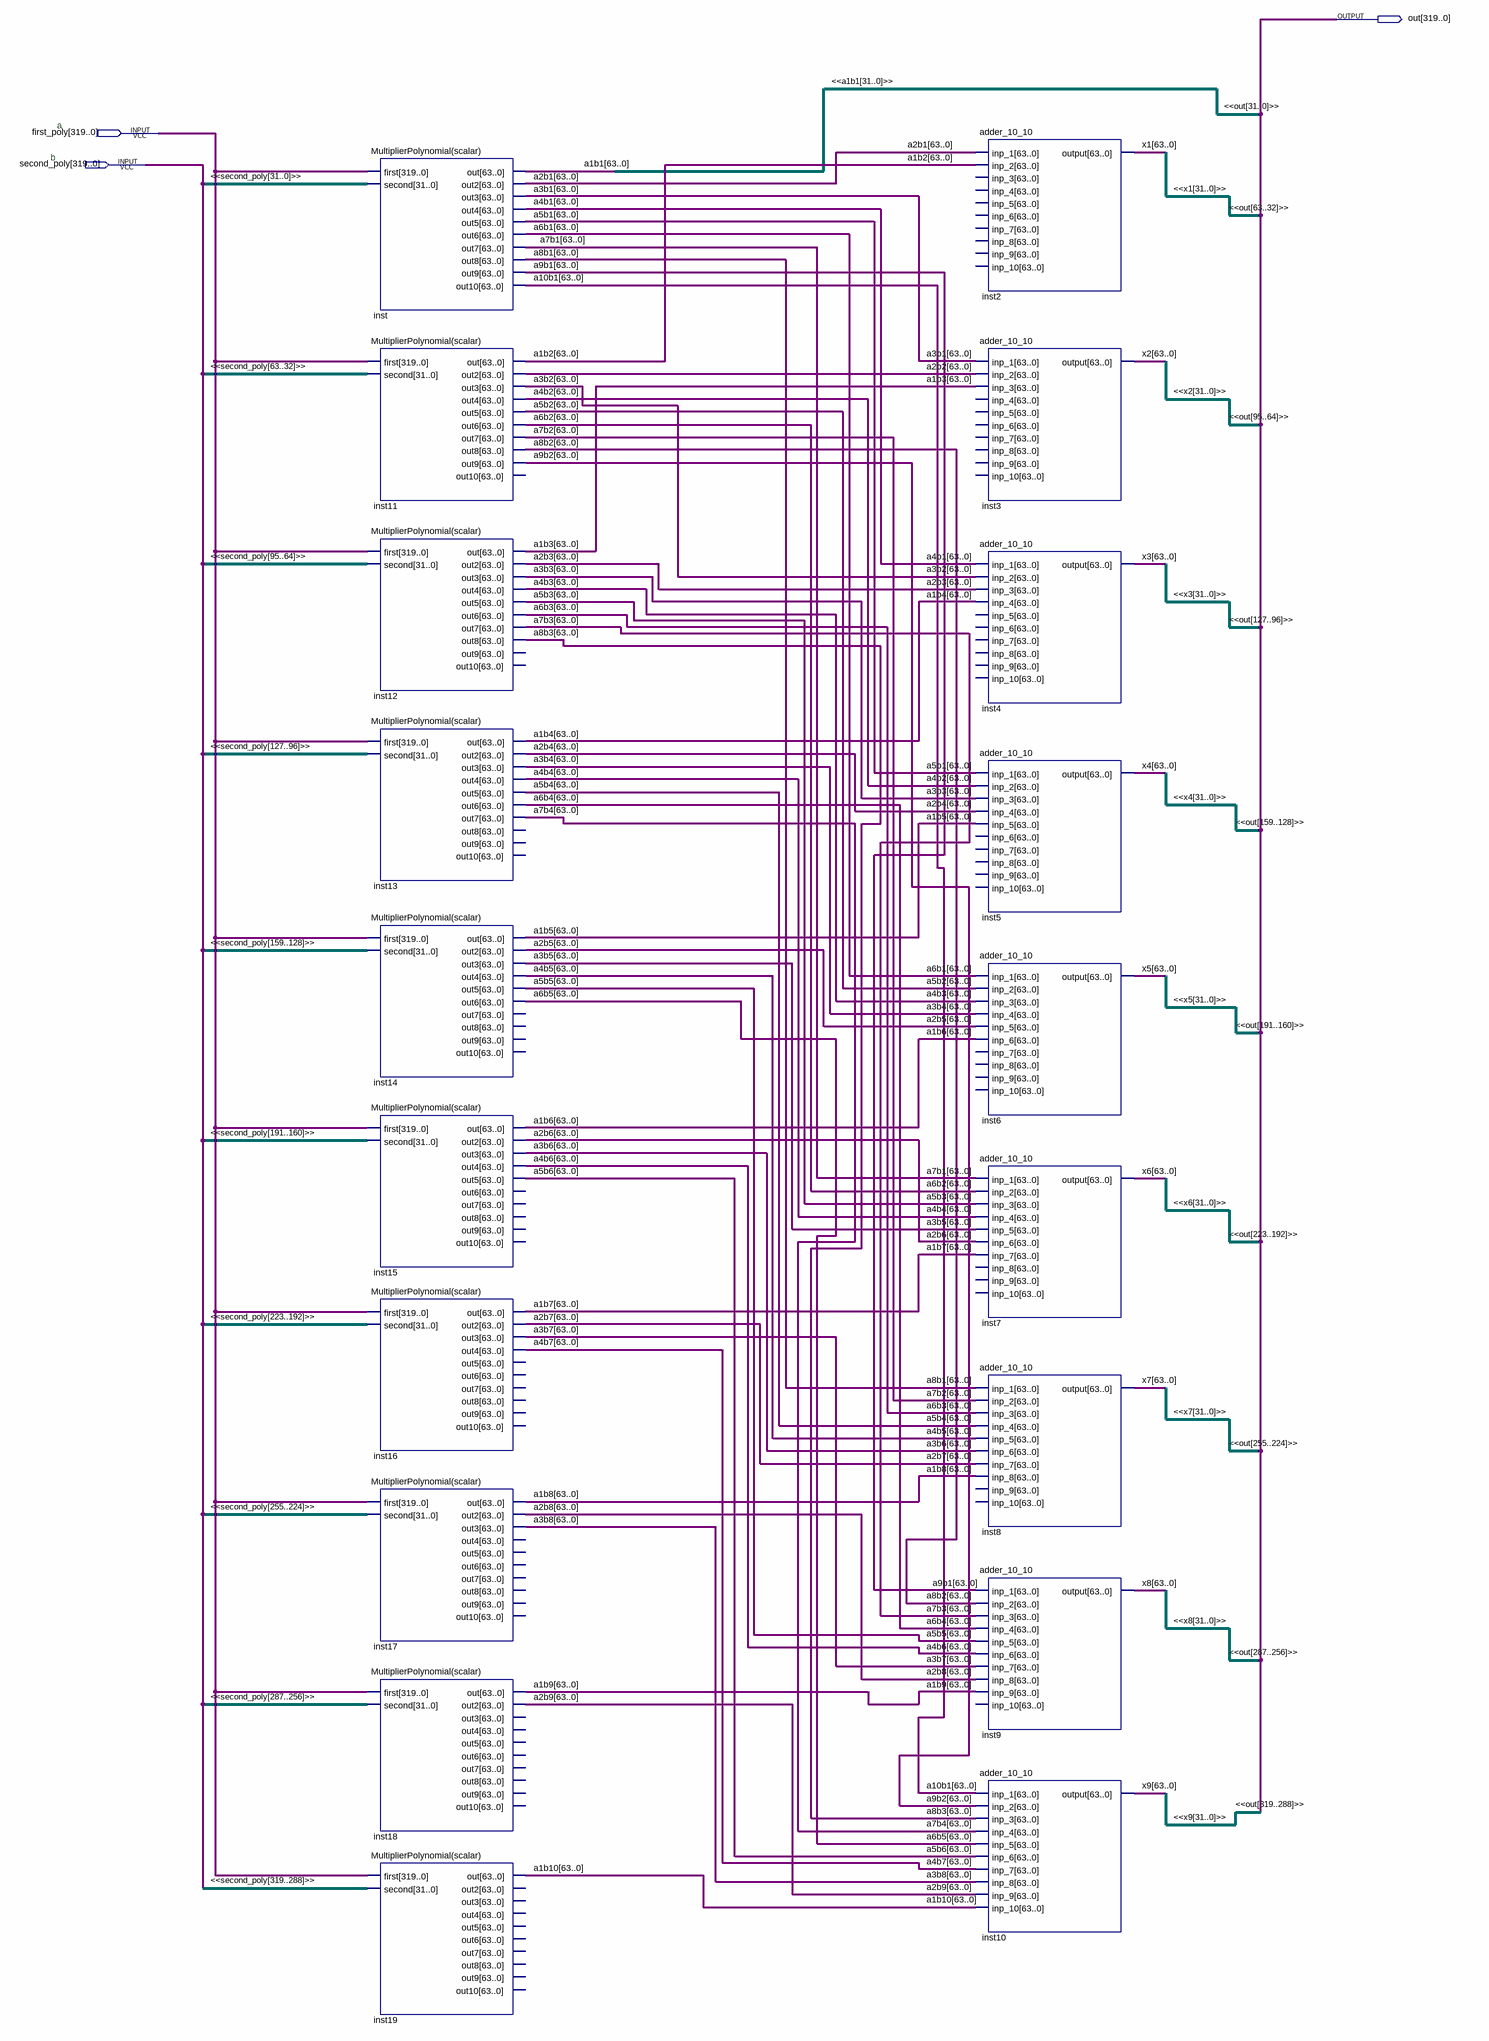
[diagram p0: schematic sheet]
// Quartus schematic MultiplierPolynomial(multi).bdf as structural Verilog: 19 symbols, 3 pins
module \MultiplierPolynomial(multi)  (
  input  [319:0] first_poly,
  input  [319:0] second_poly,
  output [319:0] out
);

  wire [63:0] a1b1, a1b2, a1b3, a1b4, a1b5, a1b6, a1b7, a1b8, a1b9, a1b10, a2b1, a2b2, a2b3, a2b4, a2b5,
       a2b6, a2b7, a2b8, a2b9, a3b1, a3b2, a3b3, a3b4, a3b5, a3b6, a3b7, a3b8, a4b1, a4b2, a4b3, a4b4, a4b5,
       a4b6, a4b7, a5b1, a5b2, a5b3, a5b4, a5b5, a5b6, a6b1, a6b2, a6b3, a6b4, a6b5, a7b1, a7b2, a7b3, a7b4,
       a8b1, a8b2, a8b3, a9b1, a9b2, a10b1, x1, x2, x3, x4, x5, x6, x7, x8, x9;

  \MultiplierPolynomial(scalar)  inst (
    .first(first_poly), .out(a1b1), .out2(a2b1), .out3(a3b1), .out4(a4b1), .out5(a5b1), .out6(a6b1),
    .out7(a7b1), .out8(a8b1), .out9(a9b1), .out10(a10b1));  // open: second
  \MultiplierPolynomial(scalar)  inst11 (
    .first(first_poly), .out(a1b2), .out2(a2b2), .out3(a3b2), .out4(a4b2), .out5(a5b2), .out6(a6b2),
    .out7(a7b2), .out8(a8b2), .out9(a9b2));  // open: second, out10
  \MultiplierPolynomial(scalar)  inst12 (
    .first(first_poly), .out(a1b3), .out2(a2b3), .out3(a3b3), .out4(a4b3), .out5(a5b3), .out6(a6b3),
    .out7(a7b3), .out8(a8b3));  // open: second, out9, out10
  \MultiplierPolynomial(scalar)  inst13 (
    .first(first_poly), .out(a1b4), .out2(a2b4), .out3(a3b4), .out4(a4b4), .out5(a5b4), .out6(a6b4),
    .out7(a7b4));  // open: second, out8, out9, out10
  \MultiplierPolynomial(scalar)  inst14 (
    .first(first_poly), .out(a1b5), .out2(a2b5), .out3(a3b5), .out4(a4b5), .out5(a5b5), .out6(a6b5));  // open: second, out7, out8, out9, out10
  \MultiplierPolynomial(scalar)  inst15 (
    .first(first_poly), .out(a1b6), .out2(a2b6), .out3(a3b6), .out4(a4b6), .out5(a5b6));  // open: second, out6, out7, out8, out9, out10
  \MultiplierPolynomial(scalar)  inst16 (
    .first(first_poly), .out(a1b7), .out2(a2b7), .out3(a3b7), .out4(a4b7));  // open: second, out5, out6, out7, out8, out9, out10
  \MultiplierPolynomial(scalar)  inst17 (
    .first(first_poly), .out(a1b8), .out2(a2b8), .out3(a3b8));  // open: second, out4, out5, out6, out7, out8, out9, out10
  \MultiplierPolynomial(scalar)  inst18 (
    .first(first_poly), .out(a1b9), .out2(a2b9));  // open: second, out3, out4, out5, out6, out7, out8, out9, out10
  \MultiplierPolynomial(scalar)  inst19 (
    .first(first_poly), .out(a1b10));  // open: second, out2, out3, out4, out5, out6, out7, out8, out9, out10
  adder_10_10 inst2 (
    .inp_1(a2b1), .inp_2(a1b2), .\output (x1));  // open: inp_3, inp_4, inp_5, inp_6, inp_7, inp_8, inp_9, inp_10
  adder_10_10 inst3 (
    .inp_1(a3b1), .inp_2(a2b2), .inp_3(a1b3), .\output (x2));  // open: inp_4, inp_5, inp_6, inp_7, inp_8, inp_9, inp_10
  adder_10_10 inst4 (
    .inp_1(a4b1), .inp_2(a3b2), .inp_3(a2b3), .inp_4(a1b4), .\output (x3));  // open: inp_5, inp_6, inp_7, inp_8, inp_9, inp_10
  adder_10_10 inst5 (
    .inp_1(a5b1), .inp_2(a4b2), .inp_3(a3b3), .inp_4(a2b4), .inp_5(a1b5), .\output (x4));  // open: inp_6, inp_7, inp_8, inp_9, inp_10
  adder_10_10 inst6 (
    .inp_1(a6b1), .inp_2(a5b2), .inp_3(a4b3), .inp_4(a3b4), .inp_5(a2b5), .inp_6(a1b6), .\output (x5));  // open: inp_7, inp_8, inp_9, inp_10
  adder_10_10 inst7 (
    .inp_1(a7b1), .inp_2(a6b2), .inp_3(a5b3), .inp_4(a4b4), .inp_5(a3b5), .inp_6(a2b6), .inp_7(a1b7),
    .\output (x6));  // open: inp_8, inp_9, inp_10
  adder_10_10 inst8 (
    .inp_1(a8b1), .inp_2(a7b2), .inp_3(a6b3), .inp_4(a5b4), .inp_5(a4b5), .inp_6(a3b6), .inp_7(a2b7),
    .inp_8(a1b8), .\output (x7));  // open: inp_9, inp_10
  adder_10_10 inst9 (
    .inp_1(a9b1), .inp_2(a8b2), .inp_3(a7b3), .inp_4(a6b4), .inp_5(a5b5), .inp_6(a4b6), .inp_7(a3b7),
    .inp_8(a2b8), .inp_9(a1b9), .\output (x8));  // open: inp_10
  adder_10_10 inst10 (
    .inp_1(a10b1), .inp_2(a9b2), .inp_3(a8b3), .inp_4(a7b4), .inp_5(a6b5), .inp_6(a5b6), .inp_7(a4b7),
    .inp_8(a3b8), .inp_9(a2b9), .inp_10(a1b10), .\output (x9));

  // Notes on the sheet:
  //   a
  //   b
endmodule
